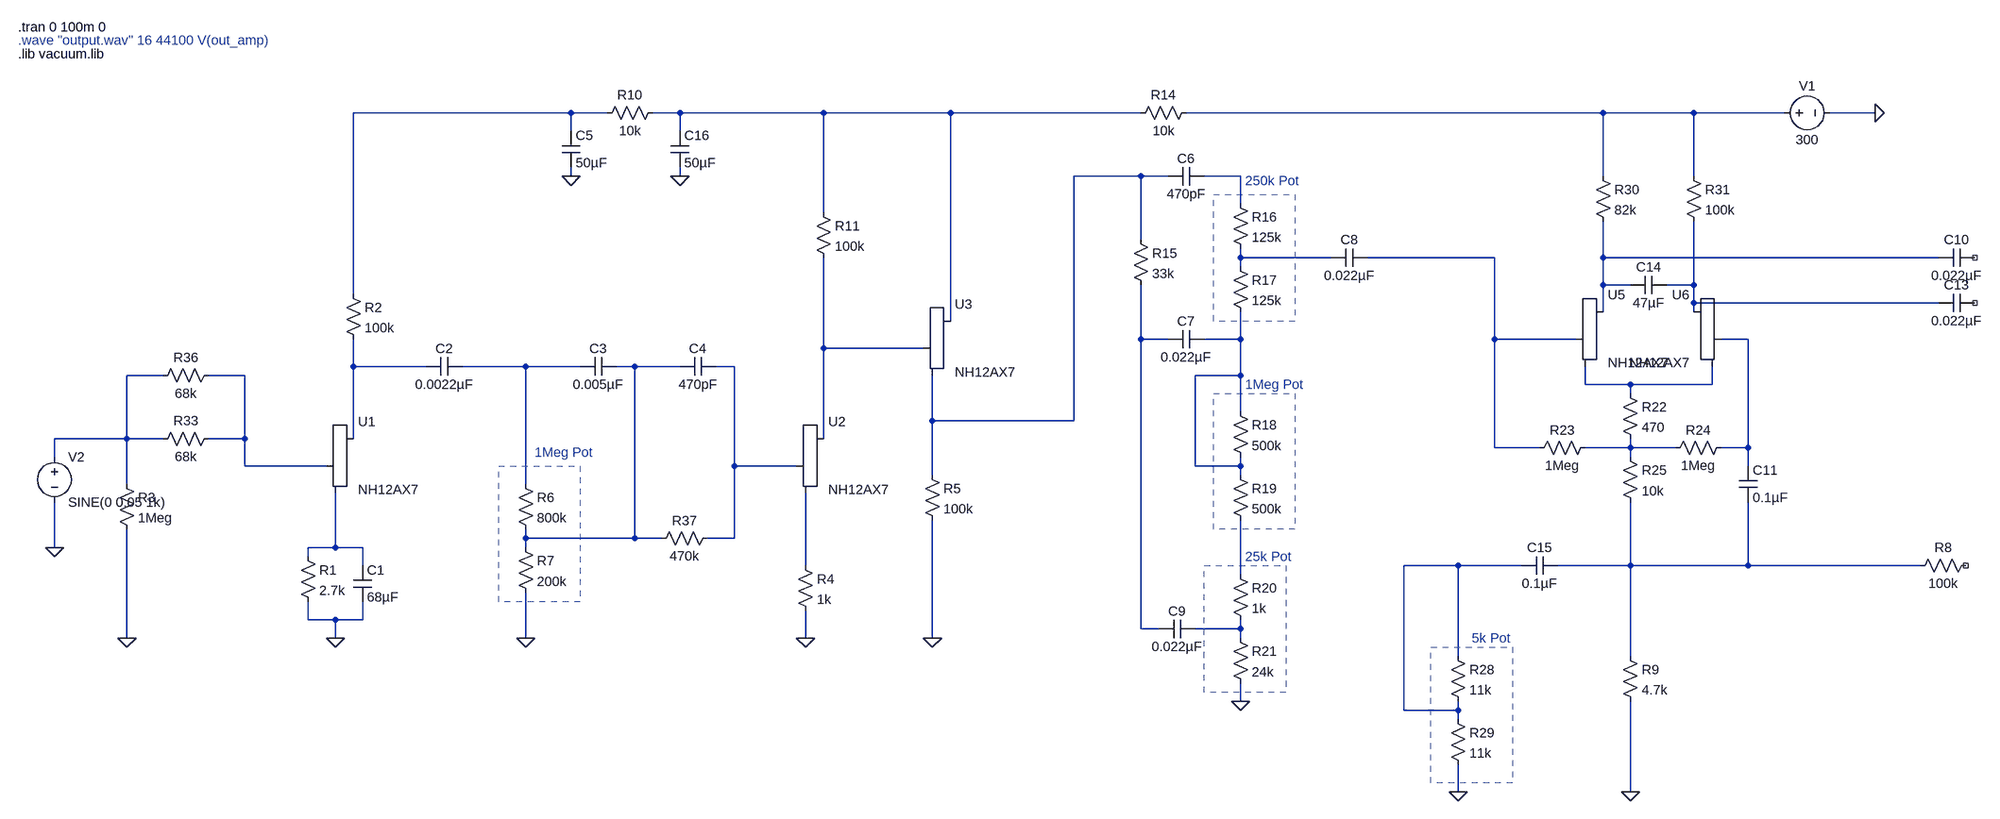
[diagram p0: schematic 1967_preamp.asc]
1967_preamp.asc, the LTspice schematic file:
Version 4
SHEET 1 3720 824
WIRE 752 -416 368 -416
WIRE 816 -416 752 -416
WIRE 944 -416 896 -416
WIRE 1216 -416 944 -416
WIRE 1440 -416 1216 -416
WIRE 2096 -416 1440 -416
WIRE 2912 -416 2176 -416
WIRE 3072 -416 2912 -416
WIRE 3232 -416 3072 -416
WIRE 3392 -416 3312 -416
WIRE 752 -384 752 -416
WIRE 944 -384 944 -416
WIRE 752 -304 752 -320
WIRE 944 -304 944 -320
WIRE 2096 -304 1728 -304
WIRE 2144 -304 2096 -304
WIRE 2272 -304 2208 -304
WIRE 2912 -304 2912 -416
WIRE 3072 -304 3072 -416
WIRE 2272 -256 2272 -304
WIRE 1216 -240 1216 -416
WIRE 2096 -192 2096 -304
WIRE 2272 -160 2272 -176
WIRE 2432 -160 2272 -160
WIRE 2720 -160 2496 -160
WIRE 2912 -160 2912 -224
WIRE 3504 -160 2912 -160
WIRE 2272 -144 2272 -160
WIRE 2912 -112 2912 -160
WIRE 2960 -112 2912 -112
WIRE 3072 -112 3072 -224
WIRE 3072 -112 3024 -112
WIRE 368 -96 368 -416
WIRE 3072 -80 3072 -112
WIRE 3504 -80 3072 -80
WIRE 2912 -64 2912 -112
WIRE 3072 -64 3072 -80
WIRE 1440 -48 1440 -416
WIRE 2096 -16 2096 -112
WIRE 2144 -16 2096 -16
WIRE 2272 -16 2272 -64
WIRE 2272 -16 2208 -16
WIRE 2720 -16 2720 -160
WIRE 2864 -16 2720 -16
WIRE 3168 -16 3120 -16
WIRE 1216 0 1216 -160
WIRE 1392 0 1216 0
WIRE 368 32 368 -16
WIRE 496 32 368 32
WIRE 672 32 560 32
WIRE 768 32 672 32
WIRE 864 32 832 32
WIRE 944 32 864 32
WIRE 1040 32 1008 32
WIRE 32 48 -32 48
WIRE 176 48 112 48
WIRE 2272 48 2272 -16
WIRE 2272 48 2192 48
WIRE 2880 64 2880 32
WIRE 2960 64 2880 64
WIRE 3104 64 3104 32
WIRE 3104 64 2960 64
WIRE 2960 80 2960 64
WIRE 2272 112 2272 48
WIRE 1408 128 1408 48
WIRE 1728 128 1728 -304
WIRE 1728 128 1408 128
WIRE -32 160 -32 48
WIRE -32 160 -160 160
WIRE 32 160 -32 160
WIRE 176 160 176 48
WIRE 176 160 112 160
WIRE 368 160 368 32
WIRE 1216 160 1216 0
WIRE 2720 176 2720 -16
WIRE 2800 176 2720 176
WIRE 2960 176 2960 160
WIRE 2960 176 2880 176
WIRE 3040 176 2960 176
WIRE 3168 176 3168 -16
WIRE 3168 176 3120 176
WIRE -160 192 -160 160
WIRE 2960 192 2960 176
WIRE 176 208 176 160
WIRE 320 208 176 208
WIRE 1040 208 1040 32
WIRE 1168 208 1040 208
WIRE 2192 208 2192 48
WIRE 2272 208 2272 192
WIRE 2272 208 2192 208
WIRE 3168 208 3168 176
WIRE 1408 224 1408 128
WIRE 2272 224 2272 208
WIRE -32 240 -32 160
WIRE 672 240 672 32
WIRE 672 336 672 320
WIRE 864 336 864 32
WIRE 864 336 672 336
WIRE 912 336 864 336
WIRE 1040 336 1040 208
WIRE 1040 336 992 336
WIRE -160 352 -160 272
WIRE 336 352 336 256
WIRE 336 352 288 352
WIRE 384 352 336 352
WIRE 672 352 672 336
WIRE 288 368 288 352
WIRE 384 384 384 352
WIRE 1184 384 1184 256
WIRE 2656 384 2560 384
WIRE 2768 384 2656 384
WIRE 2960 384 2960 272
WIRE 2960 384 2832 384
WIRE 3168 384 3168 272
WIRE 3168 384 2960 384
WIRE 3472 384 3168 384
WIRE 2272 400 2272 304
WIRE 288 480 288 448
WIRE 336 480 288 480
WIRE 384 480 384 448
WIRE 384 480 336 480
WIRE 2096 496 2096 -16
WIRE 2128 496 2096 496
WIRE 2272 496 2272 480
WIRE 2272 496 2192 496
WIRE -32 512 -32 320
WIRE 336 512 336 480
WIRE 672 512 672 432
WIRE 1184 512 1184 464
WIRE 1408 512 1408 304
WIRE 2272 512 2272 496
WIRE 2656 544 2656 384
WIRE 2960 544 2960 384
WIRE 2272 624 2272 592
WIRE 2560 640 2560 384
WIRE 2656 640 2656 624
WIRE 2656 640 2560 640
WIRE 2656 656 2656 640
WIRE 2656 784 2656 736
WIRE 2960 784 2960 624
FLAG 336 512 0
FLAG 672 512 0
FLAG 2272 624 0
FLAG 2656 784 0
FLAG -160 352 0
FLAG -32 512 0
FLAG 1184 512 0
FLAG 1408 512 0
FLAG 752 -304 0
FLAG 944 -304 0
FLAG 3392 -416 0
FLAG 2960 784 0
DATAFLAG 1552 128 ""
DATAFLAG 336 320 ""
DATAFLAG 336 320 ""
DATAFLAG 336 320 ""
SYMBOL Misc\\triode 368 208 R0
SYMATTR InstName U1
SYMATTR Value NH12AX7
SYMATTR SpiceLine X1 A G K NH12AX7
SYMBOL res 272 352 R0
SYMATTR InstName R1
SYMATTR Value 2.7k
SYMBOL cap 368 384 R0
SYMATTR InstName C1
SYMATTR Value 68µF
SYMBOL res 352 -112 R0
SYMATTR InstName R2
SYMATTR Value 100k
SYMBOL cap 560 16 R90
WINDOW 0 0 32 VBottom 2
WINDOW 3 32 32 VTop 2
SYMATTR InstName C2
SYMATTR Value 0.0022µF
SYMBOL res 656 224 R0
SYMATTR InstName R6
SYMATTR Value 800k
SYMBOL res 656 336 R0
SYMATTR InstName R7
SYMATTR Value 200k
SYMBOL res 912 -432 R90
WINDOW 0 0 56 VBottom 2
WINDOW 3 32 56 VTop 2
SYMATTR InstName R10
SYMATTR Value 10k
SYMBOL res 1200 -256 R0
SYMATTR InstName R11
SYMATTR Value 100k
SYMBOL res 2192 -432 R90
WINDOW 0 0 56 VBottom 2
WINDOW 3 32 56 VTop 2
SYMATTR InstName R14
SYMATTR Value 10k
SYMBOL cap 2208 -320 R90
WINDOW 0 0 32 VBottom 2
WINDOW 3 32 32 VTop 2
SYMATTR InstName C6
SYMATTR Value 470pF
SYMBOL res 2080 -208 R0
SYMATTR InstName R15
SYMATTR Value 33k
SYMBOL cap 2208 -32 R90
WINDOW 0 0 32 VBottom 2
WINDOW 3 32 32 VTop 2
SYMATTR InstName C7
SYMATTR Value 0.022µF
SYMBOL res 2256 -272 R0
SYMATTR InstName R16
SYMATTR Value 125k
SYMBOL res 2256 -160 R0
SYMATTR InstName R17
SYMATTR Value 125k
SYMBOL cap 2496 -176 R90
WINDOW 0 0 32 VBottom 2
WINDOW 3 32 32 VTop 2
SYMATTR InstName C8
SYMATTR Value 0.022µF
SYMBOL res 2256 96 R0
SYMATTR InstName R18
SYMATTR Value 500k
SYMBOL res 2256 208 R0
SYMATTR InstName R19
SYMATTR Value 500k
SYMBOL cap 2192 480 R90
WINDOW 0 0 32 VBottom 2
WINDOW 3 32 32 VTop 2
SYMATTR InstName C9
SYMATTR Value 0.022µF
SYMBOL res 2256 384 R0
SYMATTR InstName R20
SYMATTR Value 1k
SYMBOL res 2256 496 R0
SYMATTR InstName R21
SYMATTR Value 24k
SYMBOL Misc\\triode 2912 -16 R0
SYMATTR InstName U5
SYMATTR Value NH12AX7
SYMATTR SpiceLine X1 A G K NH12AX7
SYMBOL Misc\\triode 3072 -16 M0
SYMATTR InstName U6
SYMATTR Value NH12AX7
SYMATTR SpiceLine X1 A G K NH12AX7
SYMBOL res 2944 64 R0
SYMATTR InstName R22
SYMATTR Value 470
SYMBOL res 2896 160 R90
WINDOW 0 0 56 VBottom 2
WINDOW 3 32 56 VTop 2
SYMATTR InstName R23
SYMATTR Value 1Meg
SYMBOL res 3136 160 R90
WINDOW 0 0 56 VBottom 2
WINDOW 3 32 56 VTop 2
SYMATTR InstName R24
SYMATTR Value 1Meg
SYMBOL res 2944 176 R0
SYMATTR InstName R25
SYMATTR Value 10k
SYMBOL cap 3152 208 R0
SYMATTR InstName C11
SYMATTR Value 0.1µF
SYMBOL res 2640 528 R0
SYMATTR InstName R28
SYMATTR Value 11k
SYMBOL res 2640 640 R0
SYMATTR InstName R29
SYMATTR Value 11k
SYMBOL cap 3024 -128 R90
WINDOW 0 0 32 VBottom 2
WINDOW 3 32 32 VTop 2
SYMATTR InstName C14
SYMATTR Value 47µF
SYMBOL res 2896 -320 R0
SYMATTR InstName R30
SYMATTR Value 82k
SYMBOL res 3056 -320 R0
SYMATTR InstName R31
SYMATTR Value 100k
SYMBOL res 128 144 R90
WINDOW 0 0 56 VBottom 2
WINDOW 3 32 56 VTop 2
SYMATTR InstName R33
SYMATTR Value 68k
SYMBOL res -48 224 R0
SYMATTR InstName R3
SYMATTR Value 1Meg
SYMBOL res 128 32 R90
WINDOW 0 0 56 VBottom 2
WINDOW 3 32 56 VTop 2
SYMATTR InstName R36
SYMATTR Value 68k
SYMBOL res 1008 320 R90
WINDOW 0 0 56 VBottom 2
WINDOW 3 32 56 VTop 2
SYMATTR InstName R37
SYMATTR Value 470k
SYMBOL cap 832 16 R90
WINDOW 0 0 32 VBottom 2
WINDOW 3 32 32 VTop 2
SYMATTR InstName C3
SYMATTR Value 0.005µF
SYMBOL cap 1008 16 R90
WINDOW 0 0 32 VBottom 2
WINDOW 3 32 32 VTop 2
SYMATTR InstName C4
SYMATTR Value 470pF
SYMBOL Misc\\triode 1216 208 R0
SYMATTR InstName U2
SYMATTR Value NH12AX7
SYMATTR SpiceLine X1 A G K NH12AX7
SYMBOL res 1168 368 R0
SYMATTR InstName R4
SYMATTR Value 1k
SYMBOL Misc\\triode 1440 0 R0
SYMATTR InstName U3
SYMATTR Value NH12AX7
SYMATTR SpiceLine X1 A G K NH12AX7
SYMBOL res 1392 208 R0
SYMATTR InstName R5
SYMATTR Value 100k
SYMBOL cap 736 -384 R0
SYMATTR InstName C5
SYMATTR Value 50µF
SYMBOL cap 928 -384 R0
SYMATTR InstName C16
SYMATTR Value 50µF
SYMBOL cap 3568 -176 R90
WINDOW 0 0 32 VBottom 2
WINDOW 3 32 32 VTop 2
SYMATTR InstName C10
SYMATTR Value 0.022µF
SYMBOL cap 3568 -96 R90
WINDOW 0 0 32 VBottom 2
WINDOW 3 32 32 VTop 2
SYMATTR InstName C13
SYMATTR Value 0.022µF
SYMBOL voltage 3216 -416 R270
WINDOW 0 32 56 VTop 2
WINDOW 3 -32 56 VBottom 2
WINDOW 123 0 0 Left 0
WINDOW 39 0 0 Left 0
SYMATTR InstName V1
SYMATTR Value 300
SYMBOL res 3568 368 R90
WINDOW 0 0 56 VBottom 2
WINDOW 3 32 56 VTop 2
SYMATTR InstName R8
SYMATTR Value 100k
SYMBOL res 2944 528 R0
SYMATTR InstName R9
SYMATTR Value 4.7k
SYMBOL cap 2832 368 R90
WINDOW 0 0 32 VBottom 2
WINDOW 3 32 32 VTop 2
SYMATTR InstName C15
SYMATTR Value 0.1µF
SYMBOL voltage -160 176 R0
WINDOW 123 0 0 Left 0
WINDOW 39 0 0 Left 0
SYMATTR InstName V2
SYMATTR Value SINE(0 0.05 1k)
TEXT -224 -520 Left 2 !.lib vacuum.lib
TEXT -224 -568 Left 2 !.tran 0 100m 0
TEXT -224 -544 Left 2 ;.wave "output.wav" 16 44100 V(out_amp)
TEXT 688 184 Left 2 ;1Meg Pot
TEXT 2280 -296 Left 2 ;250k Pot
TEXT 2280 64 Left 2 ;1Meg Pot
TEXT 2280 368 Left 2 ;25k Pot
TEXT 2680 512 Left 2 ;5k Pot
RECTANGLE Normal 768 448 624 208 2
RECTANGLE Normal 2368 -48 2224 -272 2
RECTANGLE Normal 2368 320 2224 80 2
RECTANGLE Normal 2752 768 2608 528 2
RECTANGLE Normal 2352 608 2208 384 2

The netlist it stands for:
* 1967_preamp.asc
XU1 N014 N019 N022 NH12AX7 X1 A G K NH12AX7
R1 N022 0 2.7k
C1 N022 0 68µF
R2 N001 N014 100k
C2 N015 N014 0.0022µF
R6 N015 N016 800k
R7 N016 0 200k
R10 N002 N001 10k
R11 N002 N013 100k
R14 N003 N002 10k
C6 N005 N004 470pF
R15 N004 N010 33k
C7 N011 N010 0.022µF
R16 N005 N006 125k
R17 N006 N011 125k
C8 N007 N006 0.022µF
R18 N011 N011 500k
R19 N011 N026 500k
C9 N027 N010 0.022µF
R20 N026 N027 1k
R21 N027 0 24k
XU5 N008 N007 N020 NH12AX7 X1 A G K NH12AX7
XU6 N009 N012 N020 NH12AX7 X1 A G K NH12AX7
R22 N020 N021 470
R23 N021 N007 1Meg
R24 N012 N021 1Meg
R25 N021 N025 10k
C11 N012 N025 0.1µF
R28 N024 N024 11k
R29 N024 0 11k
C14 N009 N008 47µF
R30 N003 N008 82k
R31 N003 N009 100k
R33 N019 N018 68k
R3 N018 0 1Meg
R36 N019 N018 68k
R37 N017 N016 470k
C3 N016 N015 0.005µF
C4 N017 N016 470pF
XU2 N013 N017 N023 NH12AX7 X1 A G K NH12AX7
R4 N023 0 1k
XU3 N002 N013 N004 NH12AX7 X1 A G K NH12AX7
R5 N004 0 100k
C5 N001 0 50µF
C16 N002 0 50µF
C10 NC_01 N008 0.022µF
C13 NC_02 N009 0.022µF
V1 N003 0 300
R8 NC_03 N025 100k
R9 N025 0 4.7k
C15 N025 N024 0.1µF
V2 N018 0 SINE(0 0.05 1k)
.lib vacuum.lib
.tran 0 100m 0
* .wave "output.wav" 16 44100 V(out_amp)
* 1Meg Pot
* 250k Pot
* 1Meg Pot
* 25k Pot
* 5k Pot
.backanno
.end